# EAGLE schematic daughter (EAGLE 8.1.1)
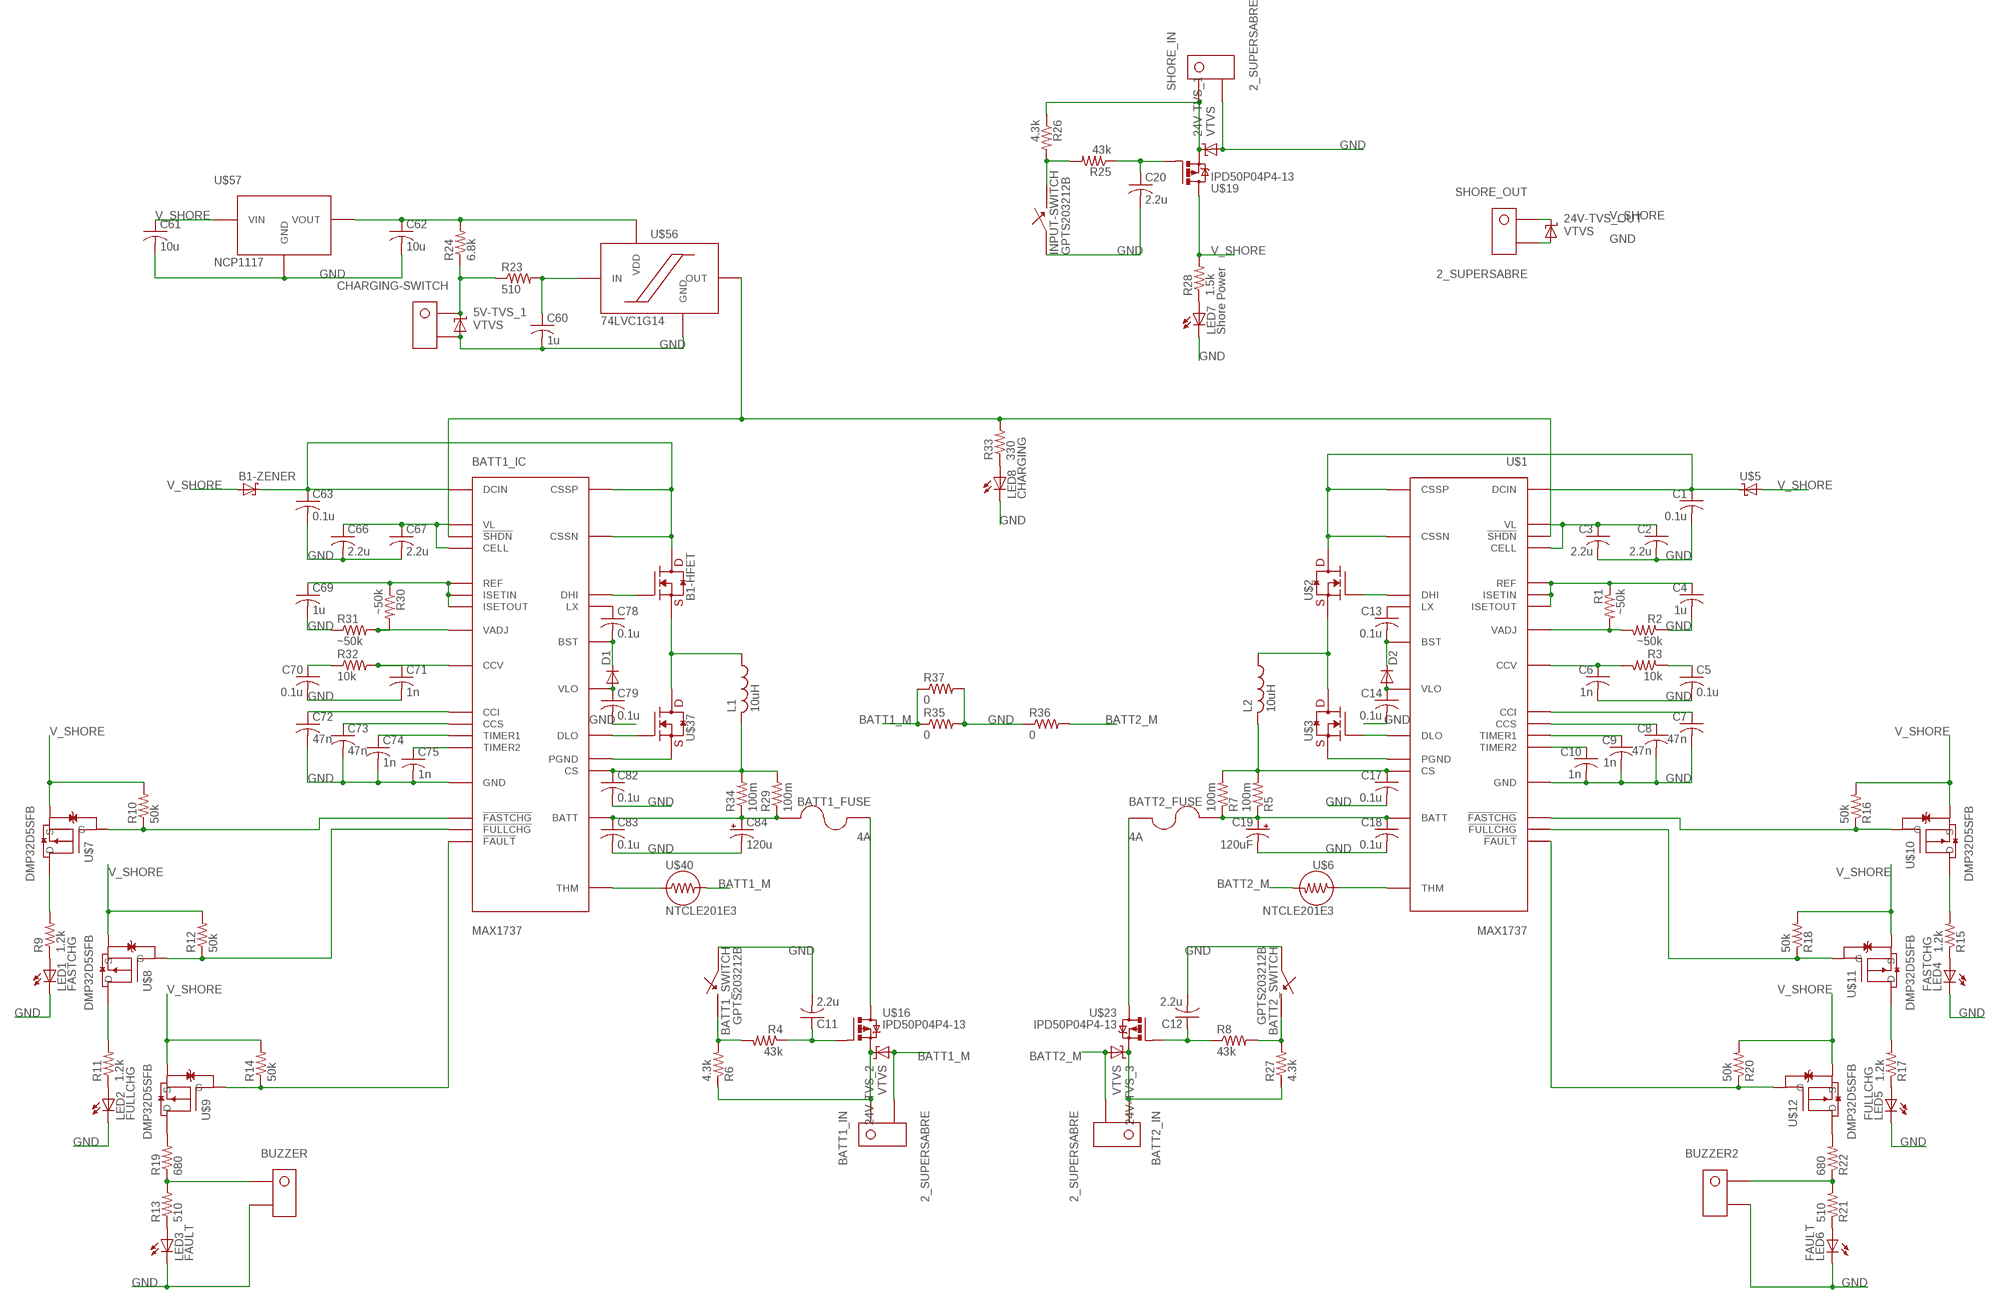
[diagram p0: schematic, sheet 1, part 1 of 2]
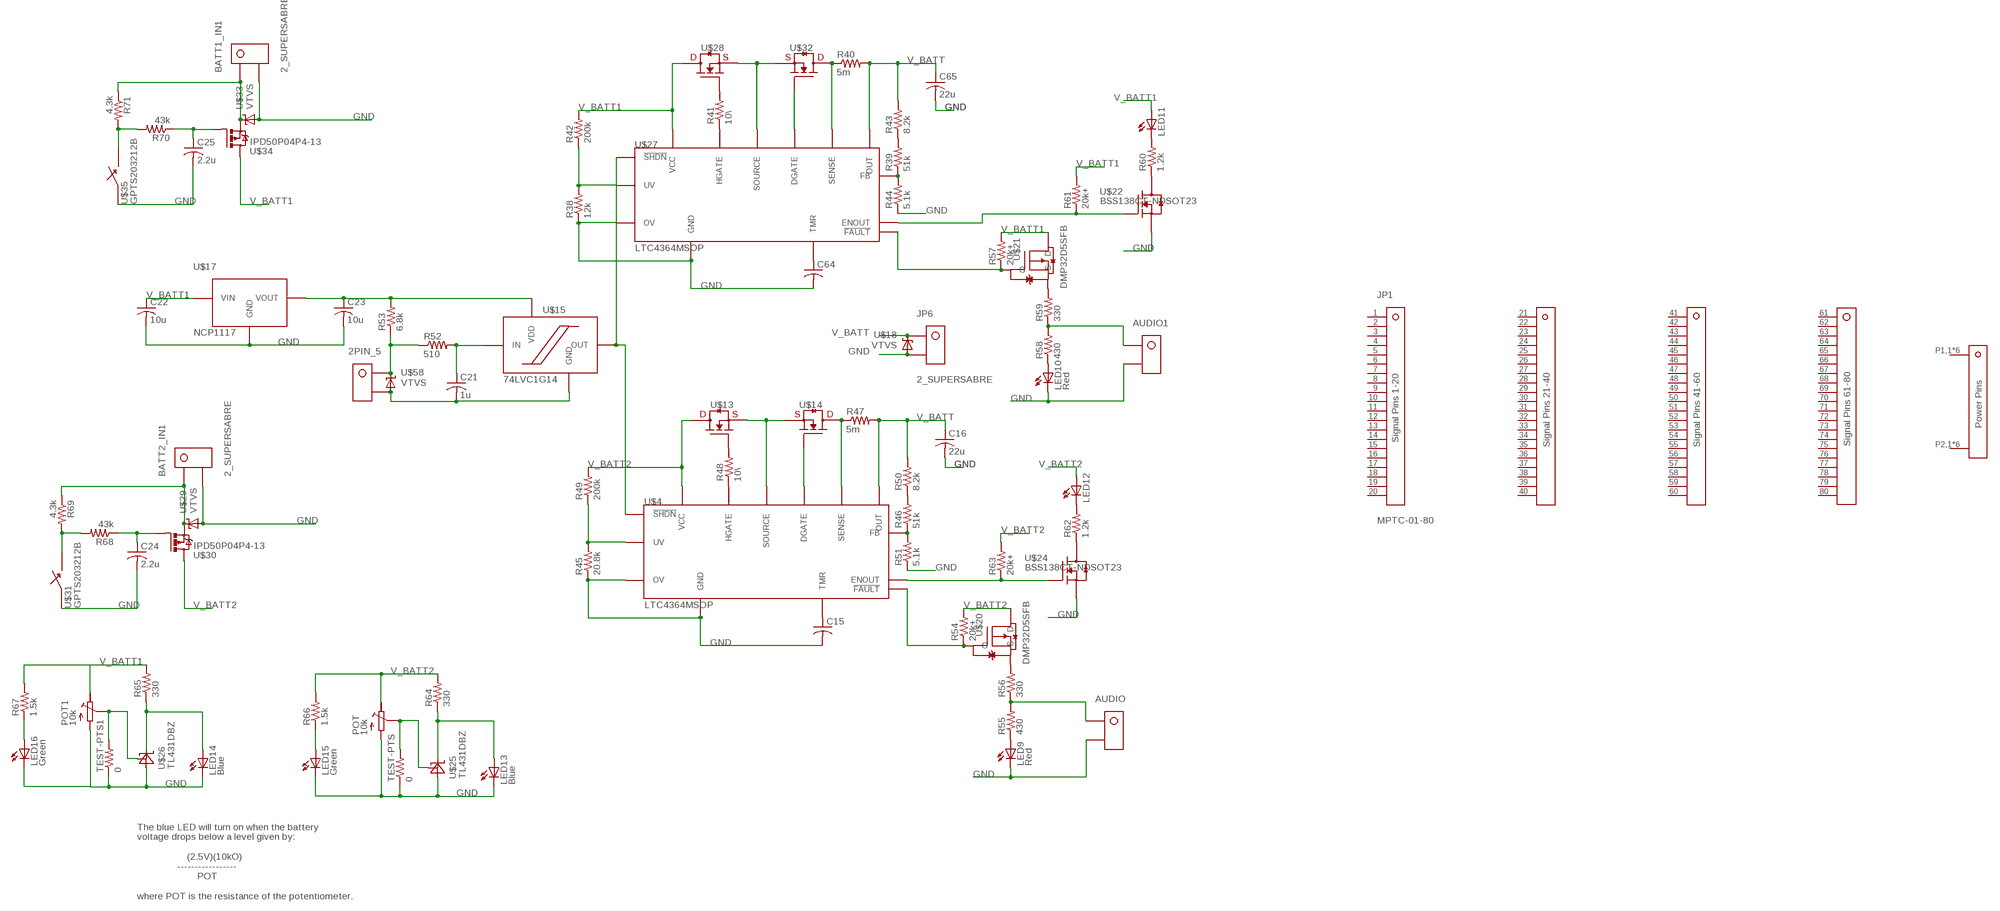
[diagram p1: schematic, sheet 1, part 2 of 2]

## Parts
2PIN_5  KK254_VERT_2PIN22-29-2021  [KK254_VERT_2PIN]
5V-TVS_1  VTVS  [DO-219AB]
24V-TVS_1  VTVS  [DO-219AB]
24V-TVS_2  VTVS  [DO-219AB]
24V-TVS_3  VTVS  [DO-219AB]
24V-TVS_OUT  VTVS  [DO-219AB]
AUDIO  KK254_VERT_2PIN22-29-2021  [KK254_VERT_2PIN]
AUDIO1  KK254_VERT_2PIN22-29-2021  [KK254_VERT_2PIN]
B1-HFET  FDMC8360LET40PWR33  [POWER33]
B1-ZENER  SCHOTTKY-DIODESOD-106  [SOD106-R]
BATT1_FUSE  4A  154-OMNI_BLOK  [154-OMNI-BLOK]
BATT1_IC  MAX1737  [QSOP28]
BATT1_IN  2_SUPERSABRE  [SUPERSABRE_2CIRCUIT]
BATT1_IN1  2_SUPERSABRE  [SUPERSABRE_2CIRCUIT]
BATT1_SWITCH  GPTS203212B  [GPTS203211B]
BATT2_FUSE  4A  154-OMNI_BLOK  [154-OMNI-BLOK]
BATT2_IN  2_SUPERSABRE  [SUPERSABRE_2CIRCUIT]
BATT2_IN1  2_SUPERSABRE  [SUPERSABRE_2CIRCUIT]
BATT2_SWITCH  GPTS203212B  [GPTS203211B]
BUZZER  KK254_VERT_2PIN22-29-2021  [KK254_VERT_2PIN]
BUZZER2  KK254_VERT_2PIN22-29-2021  [KK254_VERT_2PIN]
C1  0.1u  C-USC0805  [C0805]
C2  2.2u  C-USC0805  [C0805]
C3  2.2u  C-USC0805  [C0805]
C4  1u  C-USC0805  [C0805]
C5  0.1u  C-USC0805  [C0805]
C6  1n  C-USC0805  [C0805]
C7  47n  C-USC0805  [C0805]
C8  47n  C-USC0805  [C0805]
C9  1n  C-USC0805  [C0805]
C10  1n  C-USC0805  [C0805]
C11  2.2u  C-USC0805  [C0805]
C12  2.2u  C-USC0805  [C0805]
C13  0.1u  C-USC0805  [C0805]
C14  0.1u  C-USC0805  [C0805]
C15  C-USC0805  [C0805]
C16  22u  C-USC0805  [C0805]
C17  0.1u  C-USC0805  [C0805]
C18  0.1u  C-USC0805  [C0805]
C19  120uF  CPOL-USE3.5-8  [E3,5-8]
C20  2.2u  C-USC0805  [C0805]
C21  1u  C-USC0805  [C0805]
C22  10u  C-USC0805  [C0805]
C23  10u  C-USC0805  [C0805]
C24  2.2u  C-USC0805  [C0805]
C25  2.2u  C-USC0805  [C0805]
C60  1u  C-USC0805  [C0805]
C61  10u  C-USC0805  [C0805]
C62  10u  C-USC0805  [C0805]
C63  0.1u  C-USC0805  [C0805]
C64  C-USC0805  [C0805]
C65  22u  C-USC0805  [C0805]
C66  2.2u  C-USC0805  [C0805]
C67  2.2u  C-USC0805  [C0805]
C69  1u  C-USC0805  [C0805]
C70  0.1u  C-USC0805  [C0805]
C71  1n  C-USC0805  [C0805]
C72  47n  C-USC0805  [C0805]
C73  47n  C-USC0805  [C0805]
C74  1n  C-USC0805  [C0805]
C75  1n  C-USC0805  [C0805]
C78  0.1u  C-USC0805  [C0805]
C79  0.1u  C-USC0805  [C0805]
C82  0.1u  C-USC0805  [C0805]
C83  0.1u  C-USC0805  [C0805]
C84  120u  CPOL-USE3.5-8  [E3,5-8]
CHARGING-SWITCH  KK254_VERT_2PIN22-29-2021  [KK254_VERT_2PIN]
D1  DIODE-SOD123  [SOD123]
D2  DIODE-SOD123  [SOD123]
INPUT-SWITCH  GPTS203212B  [GPTS203211B]
JP1  MPTC-01-80  [MPTC-01-80]
JP6  2_SUPERSABRE  [SUPERSABRE_2CIRCUIT]
L1  10uH  L-USL6100  [L6100]
L2  10uH  L-USL6100  [L6100]
LED1  FASTCHG  LEDCHIP-LED0805  [CHIP-LED0805]
LED2  FULLCHG  LEDCHIP-LED0805  [CHIP-LED0805]
LED3  FAULT  LEDCHIP-LED0805  [CHIP-LED0805]
LED4  FASTCHG  LEDCHIP-LED0805  [CHIP-LED0805]
LED5  FULLCHG  LEDCHIP-LED0805  [CHIP-LED0805]
LED6  FAULT  LEDCHIP-LED0805  [CHIP-LED0805]
LED7  Shore Power  LEDCHIP-LED0805  [CHIP-LED0805]
LED8  CHARGING  LEDCHIP-LED0805  [CHIP-LED0805]
LED9  Red  LEDCHIPLED_0805  [CHIPLED_0805]
LED10  Red  LEDCHIPLED_0805  [CHIPLED_0805]
LED11  LEDCHIPLED_0805  [CHIPLED_0805]
LED12  LEDCHIPLED_0805  [CHIPLED_0805]
LED13  Blue  0805_LED  [0805]
LED14  Blue  0805_LED  [0805]
LED15  Green  0805_LED  [0805]
LED16  Green  0805_LED  [0805]
POT  10k  R-TRIMMPTV09A-4  [PTV09A-4]
POT1  10k  R-TRIMMPTV09A-4  [PTV09A-4]
R1  ~50k  R-US_R0805  [R0805]
R2  ~50k  R-US_R0805  [R0805]
R3  10k  R-US_R0805  [R0805]
R4  43k  R-US_R0805  [R0805]
R5  100m  R-US_R0805  [R0805]
R6  4.3k  R-US_R0805  [R0805]
R7  100m  R-US_R0805  [R0805]
R8  43k  R-US_R0805  [R0805]
R9  1.2k  R-US_R0805  [R0805]
R10  50k  R-US_R0805  [R0805]
R11  1.2k  R-US_R0805  [R0805]
R12  50k  R-US_R0805  [R0805]
R13  510  R-US_R0805  [R0805]
R14  50k  R-US_R0805  [R0805]
R15  1.2k  R-US_R0805  [R0805]
R16  50k  R-US_R0805  [R0805]
R17  1.2k  R-US_R0805  [R0805]
R18  50k  R-US_R0805  [R0805]
R19  680  R-US_R0805  [R0805]
R20  50k  R-US_R0805  [R0805]
R21  510  R-US_R0805  [R0805]
R22  680  R-US_R0805  [R0805]
R23  510  R-US_R0805  [R0805]
R24  6.8k  R-US_R0805  [R0805]
R25  43k  R-US_R0805  [R0805]
R26  4.3k  R-US_R0805  [R0805]
R27  4.3k  R-US_R0805  [R0805]
R28  1.5k  R-US_R0805  [R0805]
R29  100m  R-US_R0805  [R0805]
R30  ~50k  R-US_R0805  [R0805]
R31  ~50k  R-US_R0805  [R0805]
R32  10k  R-US_R0805  [R0805]
R33  330  R-US_R0805  [R0805]
R34  100m  R-US_R0805  [R0805]
R35  0  R-US_R0805  [R0805]
R36  0  R-US_R0805  [R0805]
R37  0  R-US_R0805  [R0805]
R38  12k  R-US_R0805  [R0805]
R39  51k  R-US_R0805  [R0805]
R40  5m  R-US_R0805  [R0805]
R41  10\  R-US_R0805  [R0805]
R42  200k  R-US_R0805  [R0805]
R43  8.2k  R-US_R0805  [R0805]
R44  5.1k  R-US_R0805  [R0805]
R45  20.8k  R-US_R0805  [R0805]
R46  51k  R-US_R0805  [R0805]
R47  5m  R-US_R0805  [R0805]
R48  10\  R-US_R0805  [R0805]
R49  200k  R-US_R0805  [R0805]
R50  8.2k  R-US_R0805  [R0805]
R51  5.1k  R-US_R0805  [R0805]
R52  510  R-US_R0805  [R0805]
R53  6.8k  R-US_R0805  [R0805]
R54  20k+  R-US_R0805  [R0805]
R55  430  R-US_R0805  [R0805]
R56  330  R-US_R0805  [R0805]
R57  20k+  R-US_R0805  [R0805]
R58  430  R-US_R0805  [R0805]
R59  330  R-US_R0805  [R0805]
R60  1.2k  R-US_R0805  [R0805]
R61  20k+  R-US_R0805  [R0805]
R62  1.2k  R-US_R0805  [R0805]
R63  20k+  R-US_R0805  [R0805]
R64  330  R-US_R0805  [R0805]
R65  330  R-US_R0805  [R0805]
R66  1.5k  R-US_R0805  [R0805]
R67  1.5k  R-US_R0805  [R0805]
R68  43k  R-US_R0805  [R0805]
R69  4.3k  R-US_R0805  [R0805]
R70  43k  R-US_R0805  [R0805]
R71  4.3k  R-US_R0805  [R0805]
SHORE_IN  2_SUPERSABRE  [SUPERSABRE_2CIRCUIT]
SHORE_OUT  2_SUPERSABRE  [SUPERSABRE_2CIRCUIT]
TEST-PTS  0  R-US_V526-0  [V526-0]
TEST-PTS1  0  R-US_V526-0  [V526-0]
U$1  MAX1737  [QSOP28]
U$2  FDMC8360LET40PWR33  [POWER33]
U$3  FDMC8360LET40PWR33  [POWER33]
U$4  LTC4364MSOP  [MSOP16]
U$5  SCHOTTKY-DIODESOD-106  [SOD106-R]
U$6  NTCLE201E3  [2-0.3MM-LEADS]
U$7  DMP32D5SFB  [AP02002]
U$8  DMP32D5SFB  [AP02002]
U$9  DMP32D5SFB  [AP02002]
U$10  DMP32D5SFB  [AP02002]
U$11  DMP32D5SFB  [AP02002]
U$12  DMP32D5SFB  [AP02002]
U$13  FDMC8360LET40PWR33  [POWER33]
U$14  FDMC8360LET40PWR33  [POWER33]
U$15  74LVC1G14  [TSSOP5]
U$16  IPD50P04P4-13  [TO252-3]
U$17  NCP1117  [SOT-223]
U$18  VTVS  [DO-219AB]
U$19  IPD50P04P4-13  [TO252-3]
U$20  DMP32D5SFB  [AP02002]
U$21  DMP32D5SFB  [AP02002]
U$22  BSS138CT-NDSOT23  [SOT23]
U$23  IPD50P04P4-13  [TO252-3]
U$24  BSS138CT-NDSOT23  [SOT23]
U$25  TL431DBZ  [SOT-23-3]
U$26  TL431DBZ  [SOT-23-3]
U$27  LTC4364MSOP  [MSOP16]
U$28  FDMC8360LET40PWR33  [POWER33]
U$29  VTVS  [DO-219AB]
U$30  IPD50P04P4-13  [TO252-3]
U$31  GPTS203212B  [GPTS203211B]
U$32  FDMC8360LET40PWR33  [POWER33]
U$33  VTVS  [DO-219AB]
U$34  IPD50P04P4-13  [TO252-3]
U$35  GPTS203212B  [GPTS203211B]
U$37  FDMC8360LET40PWR33  [POWER33]
U$40  NTCLE201E3  [2-0.3MM-LEADS]
U$56  74LVC1G14  [TSSOP5]
U$57  NCP1117  [SOT-223]
U$58  VTVS  [DO-219AB]

## Nets
!SHDN!: BATT1_IC.18(!SHDN!) R33.2 U$1.18(!SHDN!) U$56.P$4(OUT)
BATT1_M: 24V-TVS_2.P$1(A) BATT1_IN.P$2 R35.1 R37.1 U$40.P$2
BATT1_P: 24V-TVS_2.P$2(C) BATT1_IN.P$1 R6.1 U$16.TAB(D)
BATT2_M: 24V-TVS_3.P$1(A) BATT2_IN.P$2 R36.2 U$6.P$2
BATT2_P: 24V-TVS_3.P$2(C) BATT2_IN.P$1 R27.1 U$23.TAB(D)
BATT_1: BATT1_FUSE.P$2 BATT1_IC.7(BATT) C83.1 C84.+ R29.1 R34.1
BATT_2: BATT2_FUSE.P$2 C18.1 C19.+ R5.1 R7.1 U$1.7(BATT)
CS_1: BATT1_IC.19(CS) C82.1 L1.P$2 R29.2 R34.2
CS_2: C17.1 L2.P$2 R5.2 R7.2 U$1.19(CS)
DCIN_2: C1.1 U$1.26(CSSN) U$1.27(CSSP) U$1.28(DCIN) U$2.DRAIN U$5.C
DHI_2: U$1.25(DHI) U$2.GATE
DLO_2: U$1.21(DLO) U$3.GATE
FET-D_1: BATT1_FUSE.P$1 U$16.3(S)
FET-G_1: C11.1 R4.1 U$16.1(G)
GND: 5V-TVS_1.P$1(A) 24V-TVS_1.P$1(A) 24V-TVS_OUT.P$1(A) AUDIO1.P$2 AUDIO.P$2 BATT1_IC.6(GND) BATT1_IN1.P$2 BATT1_SWITCH.P$1 BATT2_IN1.P$2 BATT2_SWITCH.P$1 BUZZER2.P$2 BUZZER.P$2 C1.2 C2.2 C3.2 C4.2 C5.2 C6.2 C7.2 C8.2 C9.2 C10.2 C11.2 C12.2 C14.2 C15.2 C16.2 C17.2 C18.2 C19.- C20.2 C22.2 C23.2 C24.2 C25.2 C60.2 C61.2 C62.2 C63.2 C64.2 C65.2 C66.2 C67.2 C69.2 C70.2 C71.2 C72.2 C73.2 C74.2 C75.2 C79.2 C82.2 C83.2 C84.- CHARGING-SWITCH.P$2 INPUT-SWITCH.P$1 JP6.P$2 LED1.C LED2.C LED3.C LED4.C LED5.C LED6.C LED7.C LED8.C LED9.C LED10.C LED13.P$2(C) LED14.P$2(C) LED15.P$2(C) LED16.P$2(C) POT1.P$3(E) POT.P$3(E) R2.1 R31.1 R35.2 R36.1 R37.2 R38.1 R44.1 R45.1 R51.1 SHORE_IN.P$2 SHORE_OUT.P$2 TEST-PTS1.1 TEST-PTS.1 U$1.6(GND) U$4.GND U$4.OV U$17.P$1(GND) U$18.P$1(A) U$22.2(S) U$24.2(S) U$25.P$3(A) U$26.P$3(A) U$27.GND U$27.OV U$29.P$1(A) U$31.P$1 U$33.P$1(A) U$35.P$1 U$56.P$3(GND) U$57.P$1(GND)
L-IN_2: L2.P$1 U$2.SOURCE1(SOURCE) U$2.SOURCE2(SOURCE) U$2.SOURCE3(SOURCE) U$3.DRAIN
N$1: C6.1 R3.2 U$1.9(CCV)
N$2: LED1.A R9.1
N$3: C2.1 C3.1 U$1.1(VL) U$1.12(CELL)
N$4: C4.1 R1.1 U$1.2(ISETIN) U$1.3(ISETOUT) U$1.5(REF)
N$5: C5.1 R3.1
N$6: R1.2 R2.2 U$1.8(VADJ)
N$7: C7.1 U$1.11(CCI)
N$8: C8.1 U$1.10(CCS)
N$9: C9.1 U$1.13(TIMER1)
N$10: C10.1 U$1.14(TIMER2)
N$11: R38.2 R42.1 U$27.UV
N$12: LED3.A R13.1
N$13: C13.1 U$1.24(LX)
N$14: C13.2 D2.C U$1.23(BST)
N$15: R39.1 R44.2 U$27.FB
N$16: R41.1 U$27.HGATE
N$17: C64.1 U$27.TMR
N$18: R39.2 R43.1
N$19: C14.1 D2.A U$1.22(VLO)
N$20: U$27.SOURCE U$28.SOURCE1(SOURCE) U$28.SOURCE2(SOURCE) U$28.SOURCE3(SOURCE) U$32.SOURCE1(SOURCE) U$32.SOURCE2(SOURCE) U$32.SOURCE3(SOURCE)
N$21: R45.2 R49.1 U$4.UV
N$22: LED2.A R11.1
N$23: R9.2 U$7.P$3(D)
N$24: BATT1_IC.16(!FASTCHG!) R10.1 U$7.P$2(G)
N$25: LED4.A R15.1
N$26: R11.2 U$8.P$3(D)
N$27: BATT1_IC.17(!FULLCHG!) R12.1 U$8.P$2(G)
N$28: R15.2 U$10.P$3(D)
N$29: BUZZER.P$1 R13.2 R19.1
N$30: R19.2 U$9.P$3(D)
N$31: BATT1_IC.15(!FAULT!) R14.1 U$9.P$2(G)
N$32: R18.1 U$1.17(!FULLCHG!) U$11.P$2(G)
N$33: LED5.A R17.1
N$34: R17.2 U$11.P$3(D)
N$35: LED7.A R28.1
N$36: R20.1 U$1.15(!FAULT!) U$12.P$2(G)
N$37: LED6.A R21.1
N$38: R16.1 U$1.16(!FASTCHG!) U$10.P$2(G)
N$39: BUZZER2.P$1 R21.2 R22.1
N$40: B1-HFET.DRAIN B1-ZENER.C BATT1_IC.26(CSSN) BATT1_IC.27(CSSP) BATT1_IC.28(DCIN) C63.1
N$41: R22.2 U$12.P$3(D)
N$42: R46.1 R51.2 U$4.FB
N$43: R48.1 U$4.HGATE
N$44: BATT2_FUSE.P$1 U$23.3(S)
N$45: C15.1 U$4.TMR
N$46: R46.2 R50.1
N$47: C20.1 R25.1 U$19.1(G)
N$48: R48.2 U$13.GATE
N$49: C60.1 R23.2 U$56.P$2(IN)
N$50: 5V-TVS_1.P$2(C) CHARGING-SWITCH.P$1 R23.1 R24.1
N$51: INPUT-SWITCH.P$2 R25.2 R26.2
N$52: BATT1_SWITCH.P$2 R4.2 R6.2
N$53: C12.1 R8.1 U$23.1(G)
N$54: C62.1 R24.2 U$56.P$5(VDD) U$57.P$2(VOUT) U$57.P$4(VOUT)
N$55: BATT2_SWITCH.P$2 R8.2 R27.2
N$56: U$4.SOURCE U$13.SOURCE1(SOURCE) U$13.SOURCE2(SOURCE) U$13.SOURCE3(SOURCE) U$14.SOURCE1(SOURCE) U$14.SOURCE2(SOURCE) U$14.SOURCE3(SOURCE)
N$57: LED8.A R33.1
N$58: R47.1 U$4.SENSE U$14.DRAIN
N$59: R41.2 U$28.GATE
N$60: R40.1 U$27.SENSE U$32.DRAIN
N$61: U$27.DGATE U$32.GATE
N$62: BATT1_IC.8(VADJ) R30.2 R31.2
N$63: U$4.DGATE U$14.GATE
N$64: C70.1 R32.1
N$65: BATT1_IC.1(VL) BATT1_IC.12(CELL) C66.1 C67.1
N$66: 2PIN_5.P$2 C21.2 U$15.P$3(GND) U$58.P$1(A)
N$67: BATT1_IC.9(CCV) C71.1 R32.2
N$68: BATT1_IC.2(ISETIN) BATT1_IC.3(ISETOUT) BATT1_IC.5(REF) C69.1 R30.1
N$69: BATT1_IC.11(CCI) C72.1
N$70: BATT1_IC.10(CCS) C73.1
N$71: BATT1_IC.13(TIMER1) C74.1
N$72: BATT1_IC.14(TIMER2) C75.1
N$73: C21.1 R52.2 U$15.P$2(IN)
N$74: 2PIN_5.P$1 R52.1 R53.1 U$58.P$2(C)
N$75: BATT1_IC.24(LX) C78.1
N$76: BATT1_IC.23(BST) C78.2 D1.C
N$77: C23.1 R53.2 U$15.P$5(VDD) U$17.P$2(VOUT) U$17.P$4(VOUT)
N$78: U$4.SHDN(!SHDN!) U$15.P$4(OUT) U$27.SHDN(!SHDN!)
N$79: BATT1_IC.21(DLO) U$37.GATE
N$80: B1-HFET.GATE BATT1_IC.25(DHI)
N$81: B1-HFET.SOURCE1(SOURCE) B1-HFET.SOURCE2(SOURCE) B1-HFET.SOURCE3(SOURCE) L1.P$1 U$37.DRAIN
N$82: BATT1_IC.20(PGND) U$37.SOURCE1(SOURCE) U$37.SOURCE2(SOURCE) U$37.SOURCE3(SOURCE)
N$83: BATT1_IC.22(VLO) C79.1 D1.A
N$84: BATT1_IC.4(THM) U$40.P$1
N$85: LED9.A R55.1
N$86: R54.1 U$4.FLT(!FAULT!) U$20.P$2(G)
N$87: R56.2 U$20.P$1(S)
N$88: AUDIO.P$1 R55.2 R56.1
N$89: LED10.A R58.1
N$90: R57.1 U$21.P$2(G) U$27.FLT(!FAULT!)
N$91: R59.2 U$21.P$1(S)
N$92: AUDIO1.P$1 R58.2 R59.1
N$93: R60.1 U$22.3(D)
N$94: LED11.C R60.2
N$95: R62.1 U$24.3(D)
N$96: LED12.C R62.2
N$97: POT.P$2(S) TEST-PTS.2 U$25.P$2(REF)
N$98: LED13.P$1(A) R64.1 U$25.P$1(C)
N$99: POT1.P$2(S) TEST-PTS1.2 U$26.P$2(REF)
N$100: LED14.P$1(A) R65.1 U$26.P$1(C)
N$101: R63.1 U$4.ENOUT U$24.1(G)
N$102: R61.1 U$22.1(G) U$27.ENOUT
N$103: LED15.P$1(A) R66.1
N$104: LED16.P$1(A) R67.1
N$105: BATT2_IN1.P$1 R69.1 U$29.P$2(C) U$30.TAB(D)
N$106: C24.1 R68.1 U$30.1(G)
N$107: R68.2 R69.2 U$31.P$2
N$108: BATT1_IN1.P$1 R71.1 U$33.P$2(C) U$34.TAB(D)
N$109: C25.1 R70.1 U$34.1(G)
N$110: R70.2 R71.2 U$35.P$2
PGND_2: U$1.20(PGND) U$3.SOURCE1(SOURCE) U$3.SOURCE2(SOURCE) U$3.SOURCE3(SOURCE)
THM_2: U$1.4(THM) U$6.P$1
V_BATT: C16.1 C65.1 JP6.P$1 R40.2 R43.2 R47.2 R50.2 U$4.OUT U$18.P$2(C) U$27.OUT
V_BATT1: C22.1 LED11.A POT1.P$1(A) R42.2 R57.2 R61.2 R65.2 R67.2 U$17.P$3(VIN) U$21.P$3(D) U$27.VCC U$28.DRAIN U$34.3(S)
V_BATT2: LED12.A POT.P$1(A) R49.2 R54.2 R63.2 R64.2 R66.2 U$4.VCC U$13.DRAIN U$20.P$3(D) U$30.3(S)
V_SHORE: 24V-TVS_OUT.P$2(C) B1-ZENER.A C61.1 R10.2 R12.2 R14.2 R16.2 R18.2 R20.2 R28.2 SHORE_OUT.P$1 U$5.A U$7.P$1(S) U$8.P$1(S) U$9.P$1(S) U$10.P$1(S) U$11.P$1(S) U$12.P$1(S) U$19.3(S) U$57.P$3(VIN)
VIN: 24V-TVS_1.P$2(C) R26.1 SHORE_IN.P$1 U$19.TAB(D)
Unconnected: JP1.1 JP1.2 JP1.3 JP1.4 JP1.5 JP1.6 JP1.7 JP1.8 JP1.9 JP1.10 JP1.11 JP1.12 JP1.13 JP1.14 JP1.15 JP1.16 JP1.17 JP1.18 JP1.19 JP1.20 JP1.21 JP1.22 JP1.23 JP1.24 JP1.25 JP1.26 JP1.27 JP1.28 JP1.29 JP1.30 JP1.31 JP1.32 JP1.33 JP1.34 JP1.35 JP1.36 JP1.37 JP1.38 JP1.39 JP1.40 JP1.41 JP1.42 JP1.43 JP1.44 JP1.45 JP1.46 JP1.47 JP1.48 JP1.49 JP1.50 JP1.51 JP1.52 JP1.53 JP1.54 JP1.55 JP1.56 JP1.57 JP1.58 JP1.59 JP1.60 JP1.61 JP1.62 JP1.63 JP1.64 JP1.65 JP1.66 JP1.67 JP1.68 JP1.69 JP1.70 JP1.71 JP1.72 JP1.73 JP1.74 JP1.75 JP1.76 JP1.77 JP1.78 JP1.79 JP1.80 JP1.P1,1(POWER1) JP1.P1,2(POWER1) JP1.P1,3(POWER1) JP1.P1,4(POWER1) JP1.P1,5(POWER1) JP1.P1,6(POWER1) JP1.P2,1(POWER2) JP1.P2,2(POWER2) JP1.P2,3(POWER2) JP1.P2,4(POWER2) JP1.P2,5(POWER2) JP1.P2,6(POWER2)

## Notes on the sheet
- The blue LED will turn on when the battery
  voltage drops below a level given by:
  
                      (2.5V)(10kO)
                  -----------------
                          POT
  
  where POT is the resistance of the potentiometer.

## Library data of the parts
2PIN_5 AUDIO AUDIO1 BUZZER BUZZER2 CHARGING-SWITCH = molex:KK254_VERT_2PIN: KK® 254 Wire-to-Board Header, Vertical, with Friction Lock, 2 Circuits, Gold (Au) Plating Part Number: 22-29-2021 http://www.molex.com/molex/products/datasheet.jsp?part=active/0022292021_PCB_HEADERS.xml
5V-TVS_1 24V-TVS_1-24V-TVS_3 24V-TVS_OUT U$18 U$29 U$33 U$58 = diode:VTVS: Vishay VTVS5V0ASMF to VTVS63GSMF 400W TVS diodes Datasheet <http://www.mouser.com/ds/2/427/vtvs5v0asmf-1078013.pdf>
B1-HFET U$2 U$3 U$13 U$14 U$28 U$32 U$37 = fairchild:FDMC8360LET40
B1-ZENER U$5 = diode:SCHOTTKY-DIODE: Schottky Diode
BATT1_FUSE BATT2_FUSE = littelfuse:154-OMNI_BLOK: Littelfuse NANO2 Series 154 Omni-Blok fuseholder Datasheet <http://www.mouser.com/ds/2/240/Littelfuse_Fuse_154_154T_154L_154TL_Datasheet.pdf-309941.pdf>
BATT1_IC U$1 = maxim:MAX1737: Maxim MAX1737 Stand-Alone Switch-Mode Lithium-Ion Battery-Charger Controller 1-4 cell LiPo charge controller IC Datasheet <https://datasheets.maximintegrated.com/en/ds/MAX1737.pdf>
BATT1_IN BATT1_IN1 BATT2_IN BATT2_IN1 JP6 SHORE_IN SHORE_OUT = molex:2_SUPERSABRE: Molex SuperSabre 2-pin vertical header
BATT1_SWITCH BATT2_SWITCH INPUT-SWITCH U$31 U$35 = switches:GPTS203212B: CW Industries Pushbutton SPST switch ON-OFF, 1A, 30VDC Datasheet <http://switches-connectors-custom.cwind.com/Asset/GPTS203211BR2.pdf>
C1-C18 C20-C25 C60-C67 C69-C75 C78 C79 C82 C83 = resistor:C-US: CAPACITOR, American symbol
C19 C84 = resistor:CPOL-US: POLARIZED CAPACITOR, American symbol
D1 D2 = diode:DIODE-: DIODE
JP1 = samtec:MPTC-01-80: Samtec 30A Signal/Power Combo System Part number: MPTC-01-80-01 Datasheet <http://suddendocs.samtec.com/catalog_english/mptc.pdf>, Drawing <http://suddendocs.samtec.com/prints/mptc-xx-xx-xx-6.30-xx-x-v-xx-mkt.pdf>, Footprint <http://suddendocs.samtec.com/prints/mptc-xx-xx-xx-6.30-xx-x-v-xx-footprint.pdf> Created by: Ben Hurwitz Created on: 3 Dec 2015 Project: Backplane Group: Robotics @ Maryland Autonomous Submarine University of Maryland, College Park, MD, USA Description; This is an 82-pin female signal/power combination plug, with 80 5A signal pins and 2 24.7A power blades (each uses six pins). It was designed to be used on a backplane for the autonomous submarine to connect the four main daughterboards to the CPU and batteries via the backplane. It fits with the Samtec MPSC male half.
L1 L2 = resistor:L-US: INDUCTOR, American symbol
LED1-LED12 = led:LED: LED OSRAM: - CHIPLED LG R971, LG N971, LY N971, LG Q971, LY Q971, LO R971, LY R971 LH N974, LH R974 LS Q976, LO Q976, LY Q976 LO Q996 - Hyper CHIPLED LW Q18S LB Q993, LB Q99A, LB R99A - SideLED LS A670, LO A670, LY A670, LG A670, LP A670 LB A673, LV A673, LT A673, LW A673 LH A674 LY A675 LS A676, LA A676, LO A676, LY A676, LW A676 LS A679, LY A679, LG A679 - Hyper Micro SIDELED® LS Y876, LA Y876, LO Y876, LY Y876 LT Y87S - SmartLED LW L88C, LW L88S LB L89C, LB L89S, LG L890 LS L89K, LO L89K, LY L89K LS L896, LA L896, LO L896, LY L896 - TOPLED LS T670, LO T670, LY T670, LG T670, LP T670 LSG T670, LSP T670, LSY T670, LOP T670, LYG T670 LG T671, LOG T671, LSG T671 LB T673, LV T673, LT T673, LW T673 LH T674 LS T676, LA T676, LO T676, LY T676, LB T676, LH T676, LSB T676, LW T676 LB T67C, LV T67C, LT T67C, LS T67K, LO T67K, LY T67K, LW E67C LS E67B, LA E67B, LO E67B, LY E67B, LB E67C, LV E67C, LT E67C LW T67C LS T679, LY T679, LG T679 LS T770, LO T770, LY T770, LG T770, LP T770 LB T773, LV T773, LT T773, LW T773 LH T774 LS E675, LA E675, LY E675, LS T675 LS T776, LA T776, LO T776, LY T776, LB T776 LHGB T686 LT T68C, LB T68C - Hyper Mini TOPLED® LB M676 - Mini TOPLED Santana® LG M470 LS M47K, LO M47K, LY M47K Source: http://www.osram.convergy.de LUXEON: - LUMILED® LXK2-PW12-R00, LXK2-PW12-S00, LXK2-PW14-U00, LXK2-PW14-V00 LXK2-PM12-R00, LXK2-PM12-S00, LXK2-PM14-U00 LXK2-PE12-Q00, LXK2-PE12-R00, LXK2-PE12-S00, LXK2-PE14-T00, LXK2-PE14-U00 LXK2-PB12-K00, LXK2-PB12-L00, LXK2-PB12-M00, LXK2-PB14-N00, LXK2-PB14-P00, LXK2-PB14-Q00 LXK2-PR12-L00, LXK2-PR12-M00, LXK2-PR14-Q00, LXK2-PR14-R00 LXK2-PD12-Q00, LXK2-PD12-R00, LXK2-PD12-S00 LXK2-PH12-R00, LXK2-PH12-S00 LXK2-PL12-P00, LXK2-PL12-Q00, LXK2-PL12-R00 Source: www.luxeon.com KINGBRIGHT: KA-3528ASYC Source: www.kingbright.com
LED13-LED16 = led:0805_LED: LED, 0805 package. Any variety.
POT POT1 = resistor:R-TRIMM: Trimm resistor
R1-R71 TEST-PTS TEST-PTS1 = resistor:R-US_: RESISTOR, American symbol
U$4 U$27 = linear:LTC4364
U$6 U$40 = vishay:NTCLE201E3: Vishay NTC Thermistor Part No. NTCLE201E3 Datasheet <http://www.mouser.com/ds/2/427/ntclesb-278158.pdf>
U$7-U$12 U$20 U$21 = transistor-fet:DMP32D5SFB: Diodes Inc. DMP32D5SFB 30V P-MOSFET (Enhancement) Datasheet <http://www.mouser.com/ds/2/115/DMP32D5SFB-765036.pdf>
U$15 U$56 = NXP:74LVC1G14: Nexperia 74LVC1G14 Single Schmitt trigger inverter Datasheet <http://www.mouser.com/ds/2/302/74LVC1G14_Q100-839654.pdf>
U$16 U$19 U$23 U$30 U$34 = transistor-power:IPD50P04P4-13: Infineon IPD50P04P4-13 OptiMOS®-P2 Power-Transistor Datasheet <http://www.mouser.com/ds/2/196/Infineon-IPD50P04P4-13-DS-v01_02-EN-336147.pdf>
U$17 U$57 = ONSemi:NCP1117: ON Semiconductor NCP1117 5V 1A Fixed LDO Datasheet <http://www.mouser.com/ds/2/308/NCP1117-D-81326.pdf>
U$22 U$24 = transistor-fet:BSS138CT-ND: ON Semiconductor BSS138 N-MOSFET, Logic Level Datasheet <http://www.mouser.com/ds/2/149/BSS138-1006682.pdf>
U$25 U$26 = texas:TL431: Texas Instruments TL431 Adjustable shunt regulator Datasheet <http://www.ti.com/lit/ds/symlink/tl431.pdf>